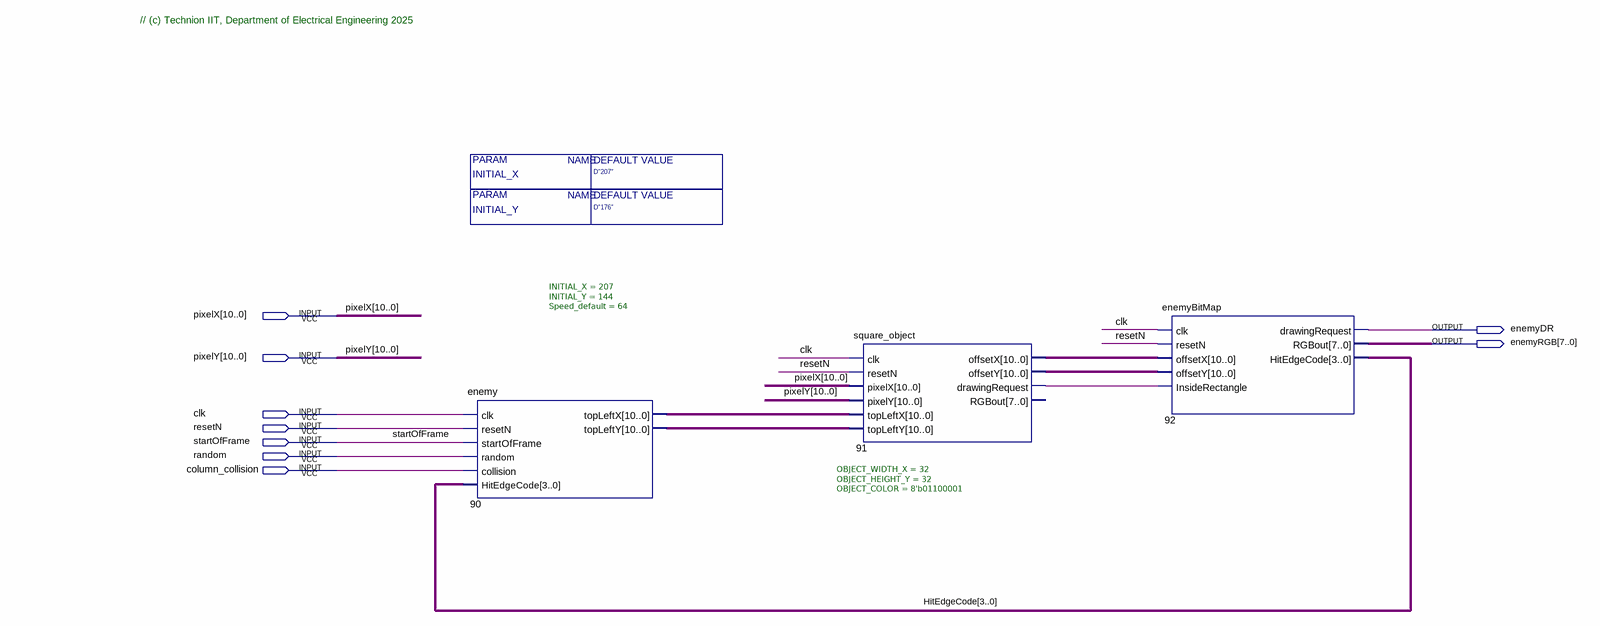
[diagram p0: schematic sheet]
// Quartus schematic Enemy2_Block_T.bdf as structural Verilog: 3 symbols, 9 pins
module Enemy2_Block_T #(parameter INITIAL_X = "D\"207\"", parameter INITIAL_Y = "D\"176\"") (
  input  [10:0] pixelX,
  input  [10:0] pixelY,
  input  clk,
  input  resetN,
  input  startOfFrame,
  input  random,
  input  column_collision,
  output enemyDR,
  output [7:0] enemyRGB
);

  wire n91_drawingrequest;
  wire [3:0] HitEdgeCode;
  wire [10:0] n90_topleftx, n90_toplefty, n91_offsetx, n91_offsety;

  enemy #(.INITIAL_X(207), .INITIAL_Y(144), .Speed_default(64)) u_90 (
    .clk(clk), .resetN(resetN), .startOfFrame(startOfFrame), .random(random), .collision(column_collision),
    .HitEdgeCode(HitEdgeCode), .topLeftX(n90_topleftx), .topLeftY(n90_toplefty));
  square_object #(.OBJECT_WIDTH_X(32), .OBJECT_HEIGHT_Y(32), .OBJECT_COLOR(8'b01100001)) u_91 (
    .clk(clk), .resetN(resetN), .pixelX(pixelX), .pixelY(pixelY), .topLeftX(n90_topleftx),
    .topLeftY(n90_toplefty), .offsetX(n91_offsetx), .offsetY(n91_offsety), .drawingRequest(n91_drawingrequest));  // open: RGBout
  enemyBitMap u_92 (
    .clk(clk), .resetN(resetN), .offsetX(n91_offsetx), .offsetY(n91_offsety),
    .InsideRectangle(n91_drawingrequest), .drawingRequest(enemyDR), .RGBout(enemyRGB),
    .HitEdgeCode(HitEdgeCode));

  // Notes on the sheet:
  //   // (c) Technion IIT, Department of Electrical Engineering 2025
endmodule
